# Altium project BerndoKeyboard-Switchboard.PrjPcb (part 1 of 4)
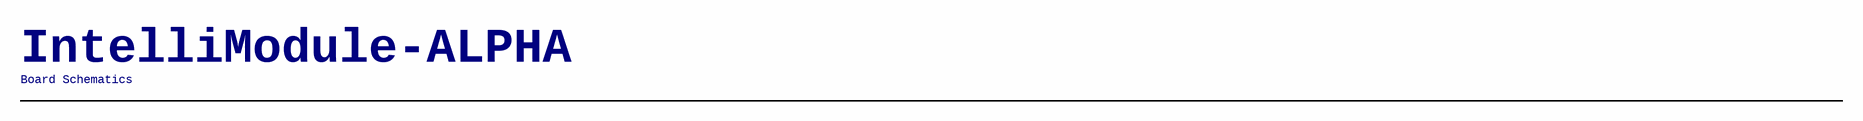
[diagram p0: [01] - Index.SchDoc]
8 sheets, 355 parts. Net scope: global (net labels, ports and power ports of the same name join across sheets).
Board file: BerndoKeyboard-Switchboard.PcbDoc
Sheets:
  [01] - Index.SchDoc
  [02] - IntelliModule Connector.SchDoc
  [03] - Keyboard Matrix 1.SchDoc
  [04] - Keyboard Matrix 2.SchDoc
  [05] - Probe Line IO Expanders.SchDoc
  [06] - Backlight LEDs.SchDoc
  [07] - USB-C Connector.SchDoc
  [08] - Voltage Regulator.SchDoc

## Sheet [01] - Index.SchDoc: Index
size A3; Date: N.A.; ApprovedBy: N.A.; CheckedBy: N.A.; Author: N.A.; CompanyName: Johannes Berndorfer; DrawnBy: JBE; Organization: N.A.; Address1: Konrad Grefe Gasse 22; Address2: 1230 Wien; Address3: AUSTRIA; Address4: N.A.; DocumentNumber: 1; Revision: A; SheetNumber: 1; SheetTotal: 8; ProjectTitle: Berndo Keyboard Switchboard PCB; Reviewer: -; Time: N.A.; ImagePath: N.A.; Application_BuildNumber: N.A.

### Notes on the sheet
- IntelliModule-ALPHA
- Board Schematics
- Title:
- Project:
- Document Nr.:
- Revision:
- Date:
- Drawn By:
- Time:
- Reviewed By:
- Sheet
- of
- Size:
- A3
- Variant:
- File:

## Sheet [02] - IntelliModule Connector.SchDoc: IntelliModule Connector
size A3; Date: N.A.; ApprovedBy: N.A.; CheckedBy: N.A.; Author: N.A.; CompanyName: Johannes Berndorfer; DrawnBy: JBE; Organization: N.A.; Address1: Konrad Grefe Gasse 22; Address2: 1230 Wien; Address3: AUSTRIA; Address4: N.A.; DocumentNumber: 2; Revision: A; SheetNumber: 2; SheetTotal: 8; ProjectTitle: Berndo Keyboard Switchboard PCB; Reviewer: -; Time: N.A.; ImagePath: N.A.; Application_BuildNumber: N.A.
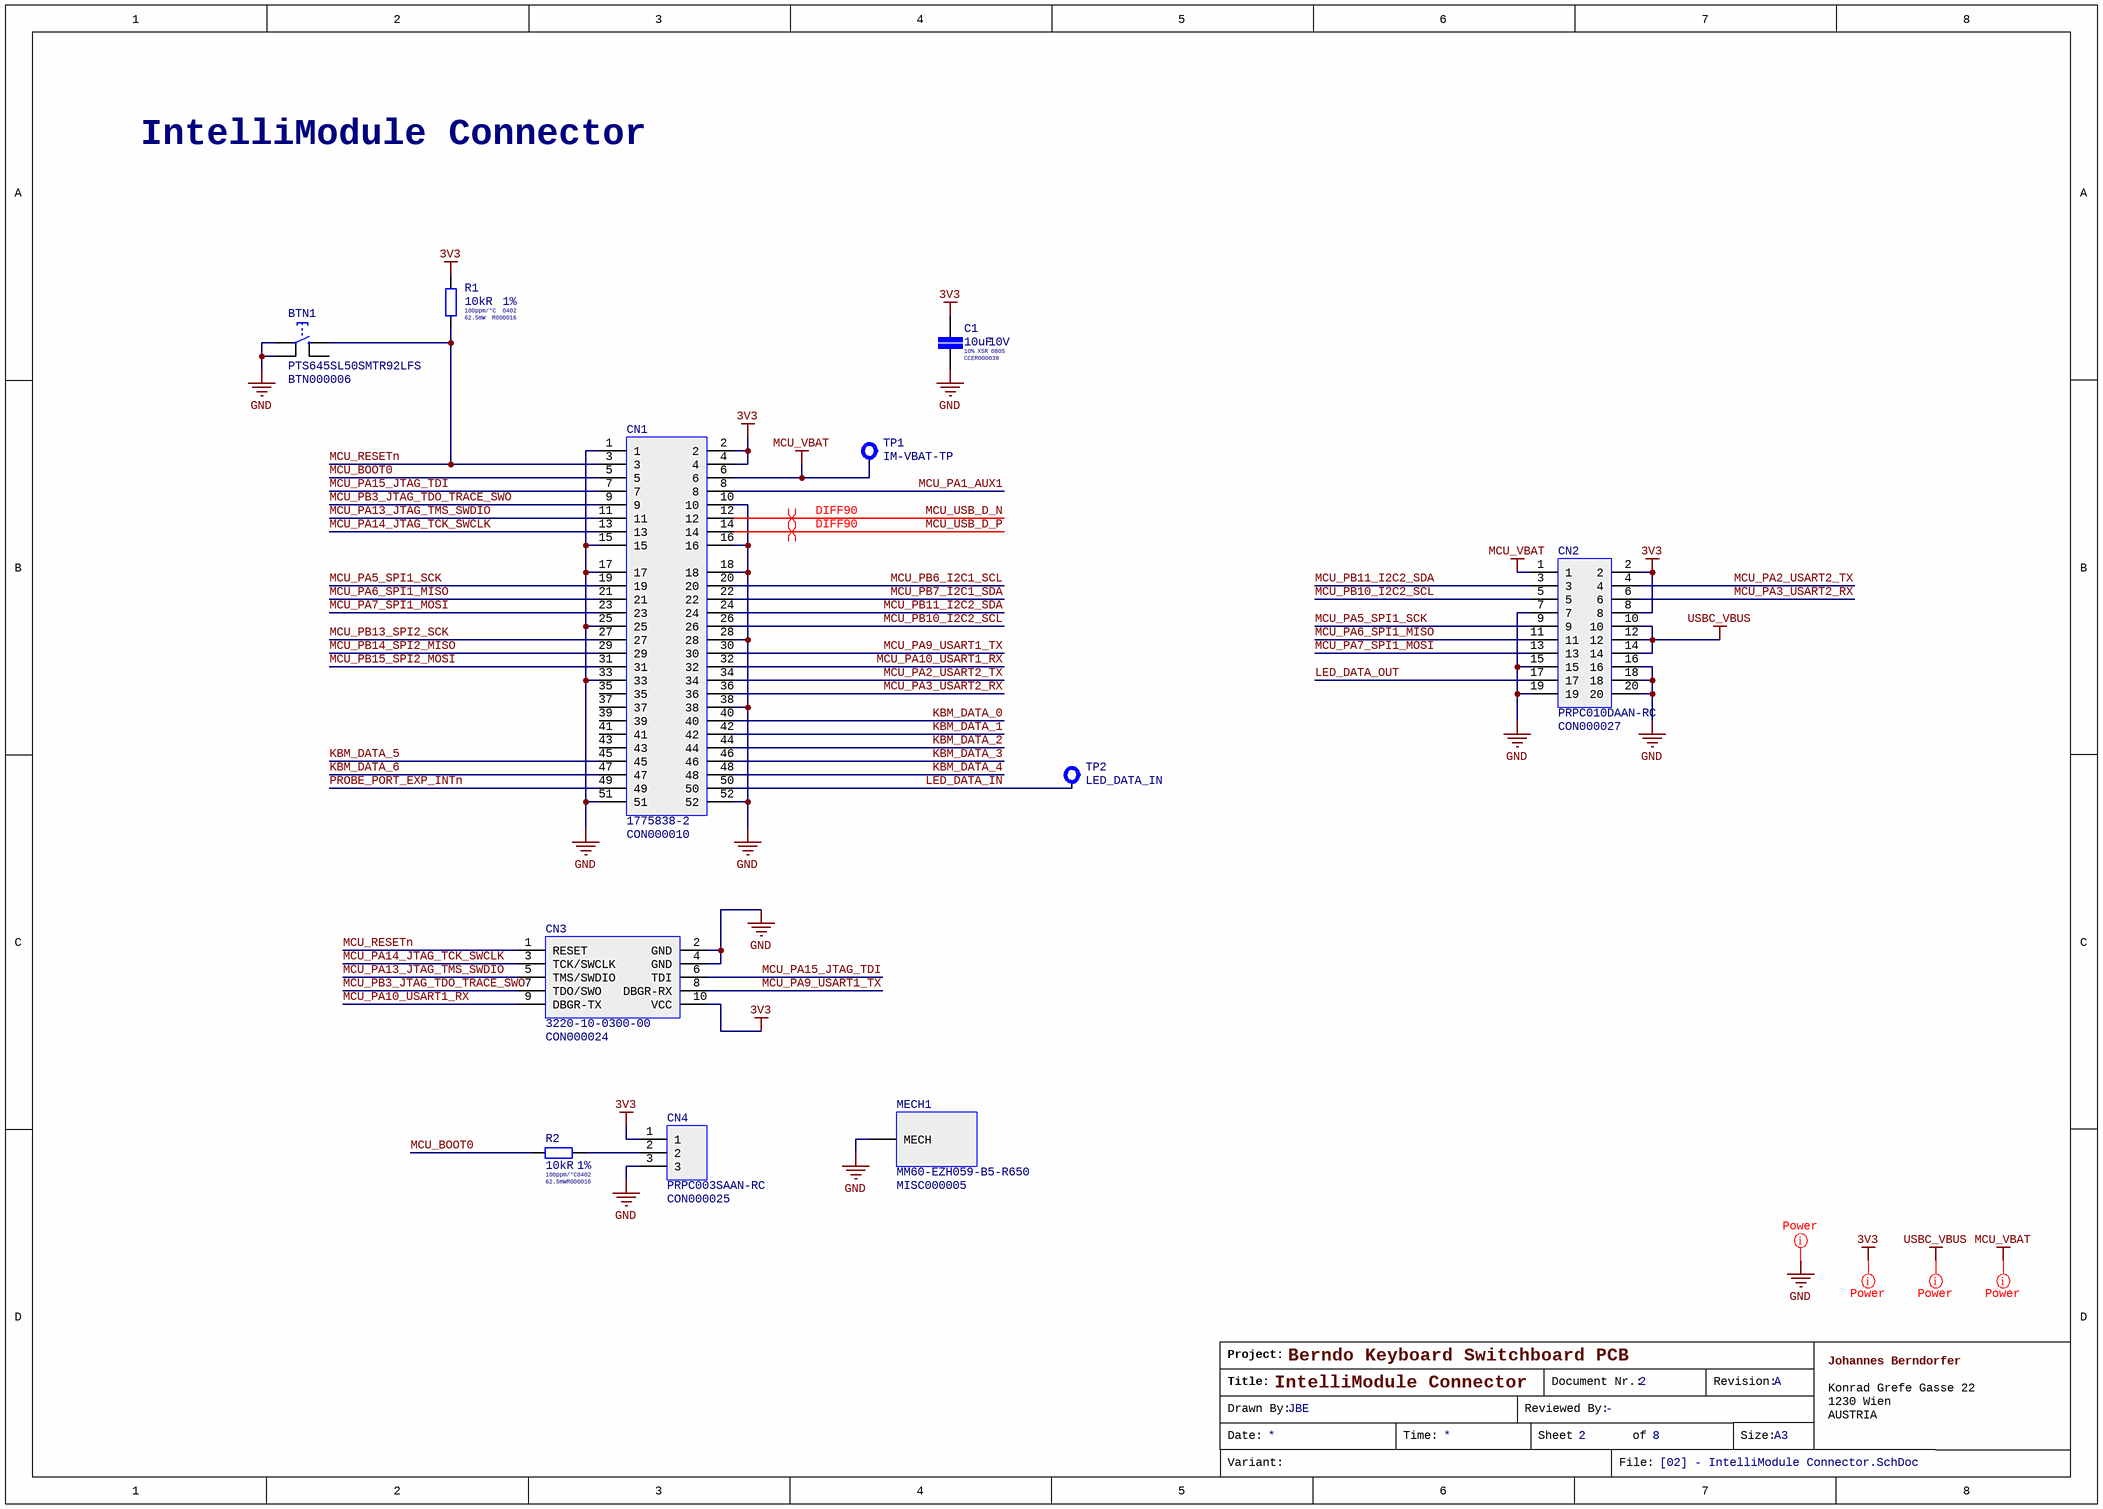
[diagram p1: [02] - IntelliModule Connector.SchDoc]

### Parts
BTN1  PTS645SL50SMTR92LFS  Internal Part Number: BTN000006  [BTN-SMD-PTS645-CK]
C1  Internal Part Number: CCER000039  Tolerance: 10%  Voltage Rating: 10V  Dielectric: X5R  Case/Package: 0805  Capacitance: 10uF  [CAP-SMD-0805-1.35MM-IPC-MED]  (hidden comment: 10uF 10V)
CN1  1775838-2  Internal Part Number: CON000010  [CON-SMD-PCIE-MINI-52POS-1775838-2-TE]
CN2  PRPC010DAAN-RC  Internal Part Number: CON000027  [CON-THT-PINHEADER-2.54MM-20POS-2X10]
CN3  3220-10-0300-00  Internal Part Number: CON000024  [CON-SMD-PINHEADER-SHIELDED-1.27MM-10POS-2X5-3220-10-0300-00-CNC-TECH]
CN4  PRPC003SAAN-RC  Internal Part Number: CON000025  [CON-THT-PINHEADER-2.54MM-3POS-1X3]
MECH1  MM60-EZH059-B5-R650  Internal Part Number: MISC000005  [CON-SMD-PCIE-MINI-LATCH-0POS-MM60-EZH059-B5-R650-JAE]
R1  Tolerance: 1%  Temperature Coefficient: 100ppm/°C  Resistance: 10kR  Power Rating: 62.5mW  Case Code (Imperial): 0402  Internal Part Number: R000016  [RES-SMD-0402-0.4MM-IPC-MED]  (hidden comment: 10kR 1%)
R2  Tolerance: 1%  Temperature Coefficient: 100ppm/°C  Resistance: 10kR  Power Rating: 62.5mW  Case Code (Imperial): 0402  Internal Part Number: R000016  [RES-SMD-0402-0.4MM-IPC-MED]  (hidden comment: 10kR 1%)
TP1  IM-VBAT-TP  [TP-SMD-CIRCULAR-1MM]
TP2  LED_DATA_IN  [TP-SMD-CIRCULAR-1MM]

### Nets
3V3: C1.1 CN1.2 CN1.4 CN2.2 CN2.8 CN3.10(VCC) CN4.1 R1.1
GND: BTN1.1 BTN1.2 C1.2 CN1.1 CN1.10 CN1.15 CN1.16 CN1.17 CN1.18 CN1.25 CN1.28 CN1.33 CN1.38 CN1.51 CN1.52 CN2.7 CN2.15 CN2.16 CN2.18 CN2.19 CN2.20 CN3.2(GND) CN3.4(GND) CN4.3 MECH1.0(MECH)
MCU_VBAT: CN1.6 CN2.1 TP1.1
USBC_VBUS: CN2.10 CN2.12 CN2.14
KBM_DATA_0: CN1.40
KBM_DATA_1: CN1.42
KBM_DATA_2: CN1.44
KBM_DATA_3: CN1.46
KBM_DATA_4: CN1.48
KBM_DATA_5: CN1.45
KBM_DATA_6: CN1.47
LED_DATA_IN: CN1.50 TP2.1
LED_DATA_OUT: CN2.17
MCU_BOOT0: CN1.5 R2.1
MCU_PA1_AUX1: CN1.8
MCU_PA2_USART2_TX: CN1.34 CN2.4
MCU_PA3_USART2_RX: CN1.36 CN2.6
MCU_PA5_SPI1_SCK: CN1.19 CN2.9
MCU_PA6_SPI1_MISO: CN1.21 CN2.11
MCU_PA7_SPI1_MOSI: CN1.23 CN2.13
MCU_PA9_USART1_TX: CN1.30 CN3.8(DBGR-RX)
MCU_PA10_USART1_RX: CN1.32 CN3.9(DBGR-TX)
MCU_PA13_JTAG_TMS_SWDIO: CN1.11 CN3.5(TMS/SWDIO)
MCU_PA14_JTAG_TCK_SWCLK: CN1.13 CN3.3(TCK/SWCLK)
MCU_PA15_JTAG_TDI: CN1.7 CN3.6(TDI)
MCU_PB3_JTAG_TDO_TRACE_SWO: CN1.9 CN3.7(TDO/SWO)
MCU_PB6_I2C1_SCL: CN1.20
MCU_PB7_I2C1_SDA: CN1.22
MCU_PB10_I2C2_SCL: CN1.26 CN2.5
MCU_PB11_I2C2_SDA: CN1.24 CN2.3
MCU_PB13_SPI2_SCK: CN1.27
MCU_PB14_SPI2_MISO: CN1.29
MCU_PB15_SPI2_MOSI: CN1.31
MCU_RESETn: BTN1.3 CN1.3 CN3.1(RESET) R1.2
MCU_USB_D_N: CN1.12
MCU_USB_D_P: CN1.14
PROBE_PORT_EXP_INTn: CN1.49
NetCN4_2: CN4.2 R2.2

Not connected (* = marked no-connect by the designer): BTN1 4; CN1 35 37 39 41 43

### Layout directives
differential pair; differential pair class DIFF90: MCU_USB_D_N, MCU_USB_D_P
net class Power: 3V3, GND, MCU_VBAT, USBC_VBUS

### Notes on the sheet
- Labels drawn without touching a wire or pin: 3V3, GND, MCU_VBAT, USBC_VBUS
- Title:
- Project:
- Document Nr.:
- Revision:
- Date:
- Drawn By:
- Time:
- Reviewed By:
- Sheet
- of
- Size:
- A3
- Variant:
- File:

### Library data of the parts
BTN1 = PTS645SL50SMTR92LFS: BTN TACT SPST-NO 12V 50mA SMD BLACK; Manufacturer: ITT C&K; Mechanical Life: 100000Cycles; Actuator Material: Nylon,Polyamide; Operating Force: 1.27N; Throw Configuration: SPST; Illumination Type: Non-Illuminated; Switch Function: Off-Mom; Actuator Type: Standard; Supplier 1: Digi-Key; Manufacturer Part Number: PTS645SL50SMTR92LFS; Stock 1: 127172; Pricing 1: 1 = 0,31000, 10 = 0,30000, 25 = 0,29000, 50 = 0,27960, 100 = 0,26410, 250 = 0,24860, 500 = 0,23822 (USD); RoHS: Yes; Mount: Surface Mount; Color: Black; Contact Plating: Silver; Contact Material: Bronze; Min Operating Temperature: -20°C; Max Operating Temperature: 60°C; Max Voltage Rating (DC): 12V; Current Rating: 50mA; Voltage Rating (DC): 12V; Packaging: Tape and Reel; Package Quantity: 1000; Max Current Rating: 50mA; Termination: Gull Wing; Orientation: Straight; Length: 6mm; Depth: 9mm; REACH SVHC: No SVHC; Lead Free: Lead Free; ComponentLink1URL: https://datasheet.ciiva.com/26927/getdatasheetpartid-760859-26927133.pdf?src-supplier=Verical; ComponentLink1Description: https://datasheet.ciiva.com/26927/getdatasheetpartid-760859-26927133.pdf?src-supplier=Verical; ComponentLink2URL: https://datasheet.ciiva.com/14920/pts645-14920742.pdf?src-supplier=Digi-Key; ComponentLink2Description: https://datasheet.ciiva.com/14920/pts645-14920742.pdf?src-supplier=Digi-Key; ComponentLink3URL: https://datasheet.ciiva.com/14920/pts645-14920743.pdf?src-supplier=Digi-Key; ComponentLink3Description: https://datasheet.ciiva.com/14920/pts645-14920743.pdf?src-supplier=Digi-Key; ComponentLink4URL: https://datasheet.ciiva.com/14920/pts645-14920744.pdf?src-supplier=Digi-Key; ComponentLink4Description: https://datasheet.ciiva.com/14920/pts645-14920744.pdf?src-supplier=Digi-Key; ComponentLink5URL: https://datasheet.ciiva.com/46429/1839862-46429337.pdf?src-supplier=Element14; ComponentLink5Description: https://datasheet.ciiva.com/46429/1839862-46429337.pdf?src-supplier=Element14; ComponentLink6URL: https://datasheet.ciiva.com/46429/1839862-46429338.pdf?src-supplier=Element14; ComponentLink6Description: https://datasheet.ciiva.com/46429/1839862-46429338.pdf?src-supplier=Element14; Supplier Part Number 1: CKN9088CT-ND
C1 = CL21A106KPFNNNG: CAP CER 10U 10V X5R 10% SMD 0805 85C SAMSUNG; Supplier 1: Digi-Key; Manufacturer 1: Samsung; Manufacturer Part Number 1: CL21A106KPFNNNG; Stock 1: 884042; Pricing 1: 1=0,14000, 10=0,10000, 100=0,04690, 500=0,03290, 1000=0,02724 (USD); RoHS: Yes; Mount: Surface Mount; Case Code (Metric): 2012; Case Code (Imperial): 0805; Min Operating Temperature: -55°C; Max Operating Temperature: 85°C; Voltage: 10V; Packaging: Tape and Reel; Package Quantity: 3000; Termination: Wraparound; Length: 2mm; Height: 1.25mm; Depth: 1.25mm; Width: 0.049inch; Thickness: 0.053inch; Radiation Hardening: No; Lead Free: Lead Free; ComponentLink1URL: https://datasheet.ciiva.com/16428/cl21a106kpfnnng-16428896.pdf?src-supplier=Future+Electronics; ComponentLink1Description: https://datasheet.ciiva.com/16428/cl21a106kpfnnng-16428896.pdf?src-supplier=Future+Electronics; ComponentLink2URL: https://datasheet.ciiva.com/26936/getdatasheetpartid-640497-26936900.pdf?src-supplier=Verical; ComponentLink2Description: https://datasheet.ciiva.com/26936/getdatasheetpartid-640497-26936900.pdf?src-supplier=Verical; Supplier Part Number 1: 1276-6456-1-ND
CN1 = 1775838-2: CON MINI PCIE CARD EDGE 52POS SMD; Manufacturer 1: TE Connectivity AMP; Connector Type: Receptacle; High Temperature Housing: Yes; Number of Positions: 52; PCB Mount Retention: Without; PCB Mounting Orientation: Vertical; Stackable: No; Pitch: 0.8mm; Row Spacing: 0.031inch; Stack Height: 5.6mm; Supplier 1: Digi-Key; Manufacturer Part Number 1: 1775838-2; Stock 1: 12692; Pricing 1: 1=0,76000, 10=0,67100, 25=0,63160, 50=0,60520, 100=0,57880, 250=0,52620 (USD); RoHS: Yes; Mount: Surface Mount; Contact Plating: Gold; Contact Material: Copper Alloy; Housing Color: Black; Housing Material: Thermoplastic; Number of Rows: 2; Packaging: Tape and Reel; Termination: Solder; Orientation: Right Angle; Package Quantity: 500; Lead Free: Lead Free; ELV: Compliant; Flammability Rating: UL94 V-0; ComponentLink1URL: https://datasheet.ciiva.com/16468/eng-ds-8-1773459-7-express-mini-card-qrg-1011-16468375.pdf?src-supplier=Avnet+Asia; ComponentLink1Description: https://datasheet.ciiva.com/16468/eng-ds-8-1773459-7-express-mini-card-qrg-1011-16468375.pdf?src-supplier=Avnet+Asia; ComponentLink2URL: https://datasheet.ciiva.com/48777/eng-ds-8-1773459-7-express-mini-card-qrg-1011-48777258.pdf?src-supplier=Onlinecomponents.com; ComponentLink2Description: https://datasheet.ciiva.com/48777/eng-ds-8-1773459-7-express-mini-card-qrg-1011-48777258.pdf?src-supplier=Onlinecomponents.com; ComponentLink3URL: https://datasheet.ciiva.com/10924/eng-ds-8-1773459-7-express-mini-card-qrg-1011-10924539.pdf?src-supplier=Avnet; ComponentLink3Description: https://datasheet.ciiva.com/10924/eng-ds-8-1773459-7-express-mini-card-qrg-1011-10924539.pdf?src-supplier=Avnet; Supplier Part Number 1: A123340CT-ND
CN2 = PRPC010DAAN-RC: CON PINHDR 2.54MM 2x10; Manufacturer: Sullins; Number of Positions: 20; Connector Type: Male Pin; Pitch: 0.1inch; Supplier 1: Digi-Key; Manufacturer Part Number: PRPC010DAAN-RC; Stock 1: 2248; Pricing 1: 1 = 0,50000, 10 = 0,46400, 25 = 0,41800, 50 = 0,37160, 100 = 0,35600, 250 = 0,32508, 500 = 0,30960 (USD); RoHS: Yes; Mount: Through Hole; Color: Black; Contact Plating: Gold; Packaging: Bulk; Number of Rows: 2; Package Quantity: 1; Termination: Solder; Row Spacing: 0.1inch; Contact Mating Length: 0.23inch; ComponentLink1URL: https://datasheet.ciiva.com/741/xrxczzzdxxn-rc-11636-b-741275.pdf?src-supplier=Digi-Key; ComponentLink1Description: https://datasheet.ciiva.com/741/xrxczzzdxxn-rc-11636-b-741275.pdf?src-supplier=Digi-Key; Supplier Part Number 1: S2011EC-10-ND
CN3 = 3220-10-0300-00: CON PINHDR SMD 1.27MM SHIELDED KEYED CNC TECH 10POS; Number of Positions: 10; Connector Type: Male Pin; Pitch: 0.05inch; Supplier 1: Digi-Key; Manufacturer 1: CNC Tech; Manufacturer Part Number 1: 3220-10-0300-00; Stock 1: 107713; Pricing 1: 1=0,74000, 10=0,69000, 100=0,52900, 500=0,46000, 3200=0,34500, 6400=0,33350, 12800=0,30590 (USD); RoHS: Yes; Mount: Surface Mount; Contact Plating: Gold; Package Quantity: 3200; Number of Rows: 2; Packaging: Tray; Termination: Solder; Row Spacing: 0.05inch; ComponentLink1URL: https://datasheet.ciiva.com/18655/3220-xx-0300-00-18655365.pdf?src-supplier=Digi-Key; ComponentLink1Description: https://datasheet.ciiva.com/18655/3220-xx-0300-00-18655365.pdf?src-supplier=Digi-Key; Supplier Part Number 1: 1175-1629-ND
CN4 = PRPC003SAAN-RC: CON PINHDR 2.54MM 1x03; Manufacturer: Sullins; Number of Positions: 3; Connector Type: Male Pin; Pitch: 0.1inch; Supplier 1: Digi-Key; Manufacturer Part Number: PRPC003SAAN-RC; Stock 1: 16923; Pricing 1: 1 = 0,12000, 10 = 0,10900, 25 = 0,08120, 50 = 0,06960, 100 = 0,06730, 250 = 0,05804, 500 = 0,05572 (USD); RoHS: Yes; Mount: Through Hole; Color: Black; Contact Plating: Gold; Package Quantity: 1; Number of Rows: 1; Packaging: Bulk; Termination: Solder; Contact Mating Length: 0.23inch; ComponentLink1URL: https://datasheet.ciiva.com/741/xrxczzzsxxn-rc-st-11635-b-741242.pdf?src-supplier=Digi-Key; ComponentLink1Description: https://datasheet.ciiva.com/741/xrxczzzsxxn-rc-st-11635-b-741242.pdf?src-supplier=Digi-Key; Supplier Part Number 1: S1011EC-03-ND
MECH1 = MM60-EZH059-B5-R650: CARD LATCH MINI PCIE 3.05mm HEIGHT; Manufacturer: JAE Electronics; Contact Resistance: 55mR; Current Rating: 500mA; Mating Cycles: 50; Supplier 1: Digi-Key; Manufacturer Part Number: MM60-EZH059-B5-R650; Stock 1: 14566; Pricing 1: 1 = 1,22000, 10 = 1,07500, 25 = 1,01160, 50 = 0,96940, 100 = 0,92720, 250 = 0,84296 (USD); RoHS: Yes; Mount: Socket; Case/Package: SMD/SMT; Contact Material: Stainless Steel,Tin; Contact Plating: Tin; Min Operating Temperature: -40°C; Max Operating Temperature: 80°C; Packaging: Tape and Reel; Package Quantity: 1; Termination: Solder; Height: 5.9mm; REACH SVHC: Unknown; Flammability Rating: UL94 V-0; ComponentLink1URL: https://datasheet.ciiva.com/682/sj105221-682461.pdf?src-supplier=Digi-Key; ComponentLink1Description: https://datasheet.ciiva.com/682/sj105221-682461.pdf?src-supplier=Digi-Key; ComponentLink2URL: https://datasheet.ciiva.com/7655/332202-7655815.pdf?src-supplier=Element14; ComponentLink2Description: https://datasheet.ciiva.com/7655/332202-7655815.pdf?src-supplier=Element14; Supplier Part Number 1: 670-2277-1-ND
R1 R2 = RC0402FR-0710KL: RES 10K 1% 1/16W SMD 0402 YAEGO; Manufacturer: Yageo; Voltage Rating: 50V; Manufacturer Part Number: RC0402FR-0710KL; RoHS: Yes; Case/Package: 0402; Number of Pins: 2; Case Code (Metric): 1005; Min Operating Temperature: -55°C; Max Operating Temperature: 155°C; Packaging: Tape and Reel; Composition: Thick Film; Voltage Rating (DC): 50V; Termination: SMD/SMT; Military Standard: Not; Working Voltage: 50V; Number of Terminations: 2; Length: 1mm; Height: 0.32mm; Width: 0.5mm; Depth: 0.5mm; Lead Pitch: 0.2mm; REACH SVHC: No SVHC; Lead Free: Lead Free; ComponentLink1URL: https://datasheet.ciiva.com/7660/38568-7660787.pdf?src-supplier=Element14; ComponentLink1Description: https://datasheet.ciiva.com/7660/38568-7660787.pdf?src-supplier=Element14; ComponentLink2URL: https://datasheet.ciiva.com/7849/1784430-7849813.pdf?src-supplier=Element14; ComponentLink2Description: https://datasheet.ciiva.com/7849/1784430-7849813.pdf?src-supplier=Element14; ComponentLink3URL: https://datasheet.ciiva.com/7849/1686128-7849814.pdf?src-supplier=Element14; ComponentLink3Description: https://datasheet.ciiva.com/7849/1686128-7849814.pdf?src-supplier=Element14; ComponentLink4URL: https://datasheet.ciiva.com/7849/1784430-7849815.pdf?src-supplier=Element14; ComponentLink4Description: https://datasheet.ciiva.com/7849/1784430-7849815.pdf?src-supplier=Element14; ComponentLink5URL: https://datasheet.ciiva.com/22747/1018594-22747512.pdf?src-supplier=Element14; ComponentLink5Description: https://datasheet.ciiva.com/22747/1018594-22747512.pdf?src-supplier=Element14; ComponentLink6URL: https://datasheet.ciiva.com/12667/pyu-rc0402-51-rohs-l-6-r-12667067.pdf?src-supplier=Mouser; ComponentLink6Description: https://datasheet.ciiva.com/12667/pyu-rc0402-51-rohs-l-6-r-12667067.pdf?src-supplier=Mouser; ComponentLink7URL: https://datasheet.ciiva.com/7983/1018594-7983486.pdf?src-supplier=Element14; ComponentLink7Description: https://datasheet.ciiva.com/7983/1018594-7983486.pdf?src-supplier=Element14; Package Quantity: 10000; ComponentLink8URL: https://datasheet.ciiva.com/11819/0900766b80c66297-11819487.pdf?src-supplier=RSComponents; ComponentLink8Description: https://datasheet.ciiva.com/11819/0900766b80c66297-11819487.pdf?src-supplier=RSComponents; ComponentLink9URL: https://datasheet.ciiva.com/15189/getdatasheetpartid-329253-15189431.pdf?src-supplier=Verical; ComponentLink9Description: https://datasheet.ciiva.com/15189/getdatasheetpartid-329253-15189431.pdf?src-supplier=Verical; ComponentLink10URL: https://datasheet.ciiva.com/24070/pyu-rc0402-51-rohs-l-6-r-8721-24070077.pdf?src-supplier=Mouser; ComponentLink10Description: https://datasheet.ciiva.com/24070/pyu-rc0402-51-rohs-l-6-r-8721-24070077.pdf?src-supplier=Mouser; ComponentLink11URL: https://datasheet.ciiva.com/7849/1018594-7849966.pdf?src-supplier=Element14; ComponentLink11Description: https://datasheet.ciiva.com/7849/1018594-7849966.pdf?src-supplier=Element14; ComponentLink12URL: https://datasheet.ciiva.com/7849/1018594-7849967.pdf?src-supplier=Element14; ComponentLink12Description: https://datasheet.ciiva.com/7849/1018594-7849967.pdf?src-supplier=Element14; ComponentLink13URL: https://datasheet.ciiva.com/17070/pyu-rc0402-51-rohs-l-6-r-17070335.pdf?src-supplier=Future+Electronics; ComponentLink13Description: https://datasheet.ciiva.com/17070/pyu-rc0402-51-rohs-l-6-r-17070335.pdf?src-supplier=Future+Electronics; Supplier 1: Digi-Key; Stock 1: 86154015; Pricing 1: 1 = 0,10000, 10 = 0,01600, 100 = 0,00670, 1000 = 0,00301, 2500 = 0,00261, 5000 = 0,00215 (USD); Supplier Part Number 1: 311-10.0KLRCT-ND
TP1 TP2 = TESTPOINT_CIRCULAR_1MM